# EAGLE schematic erc practice (EAGLE 9.6.2)
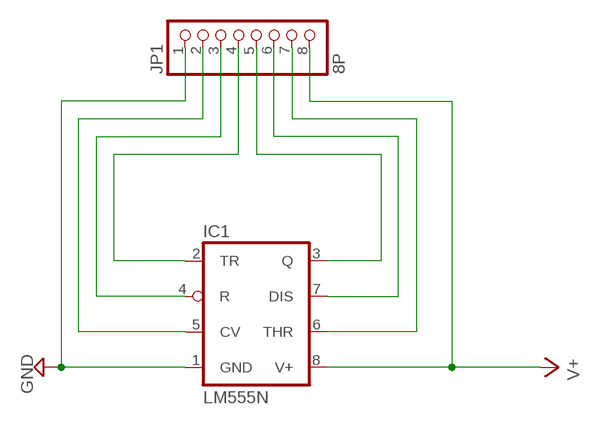
[diagram p0: schematic, sheet 1]

## Parts
IC1  LM555N  [DIL08]
JP1  8P  PINHD-1X8  [1X08]

## Nets
GND: IC1.1(GND) JP1.1
N$2: IC1.5(CV) JP1.2
N$3: IC1.4(R) JP1.3
N$4: IC1.2(TR) JP1.4
N$5: IC1.3(Q) JP1.5
N$6: IC1.7(DIS) JP1.6
N$7: IC1.6(THR) JP1.7
V+: IC1.8(V+) JP1.8

## Library data of the parts
IC1 = linear:*555: TIMER
JP1 = pinhead:PINHD-1X8: PIN HEADER